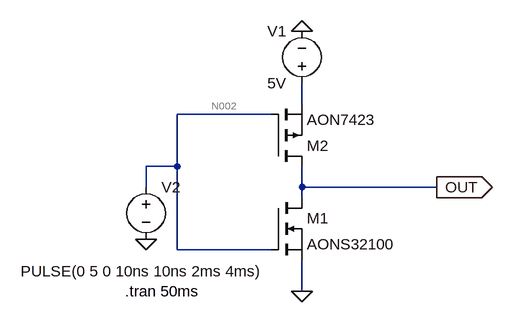
[diagram p0: schematic Inverseuse1.asc]
Inverseuse1.asc, the LTspice schematic file:
Version 4
SHEET 1 880 680
WIRE 336 48 336 16
WIRE 288 64 144 64
WIRE 144 144 144 64
WIRE 144 144 96 144
WIRE 96 176 96 144
WIRE 336 176 336 144
WIRE 544 176 336 176
WIRE 336 192 336 176
WIRE 144 272 144 144
WIRE 288 272 144 272
WIRE 336 336 336 288
FLAG 336 -64 0
FLAG 336 336 0
FLAG 96 256 0
FLAG 544 176 OUT
IOPIN 544 176 Out
SYMBOL nmos 288 192 R0
SYMATTR InstName M1
SYMATTR Value AONS32100
SYMBOL pmos 288 144 M180
SYMATTR InstName M2
SYMATTR Value AON7423
SYMBOL voltage 336 32 R180
WINDOW 0 24 96 Left 2
WINDOW 3 24 16 Left 2
WINDOW 123 0 0 Left 0
WINDOW 39 0 0 Left 0
SYMATTR InstName V1
SYMATTR Value 5V
SYMBOL voltage 96 160 R0
WINDOW 3 -193 145 Left 2
WINDOW 123 0 0 Left 0
WINDOW 39 0 0 Left 0
SYMATTR InstName V2
SYMATTR Value PULSE(0 5 0 10ns 10ns 2ms 4ms)
TEXT 64 336 Left 2 !.tran 50ms

The netlist it stands for:
* Inverseuse1.asc
M1 OUT N002 0 0 AONS32100
M2 OUT N002 N001 N001 AON7423
V1 N001 0 5V
V2 N002 0 PULSE(0 5 0 10ns 10ns 2ms 4ms)
.model NMOS NMOS
.model PMOS PMOS
.lib standard.mos
.tran 50ms
.backanno
.end

* Results of the author's LTspice run, read from the files saved beside the schematic
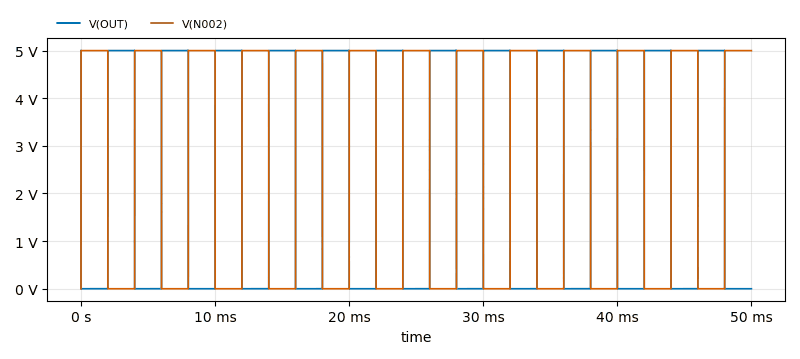
[diagram p1: Transient Analysis of Inverseuse1.asc, plotted from the saved traces]
* Transient Analysis, 1 run:
*   V(OUT): min -927.4 µV, max 5.005 V, average 2.4 V, rms 3.464 V, last 0 V
*   V(N002): min 0 V, max 5 V, average 2.6 V, rms 3.606 V, last 5 V